# Altium schematic sheet smartlock.SchDoc
size A4; SheetNumber: 1; SheetTotal: 1
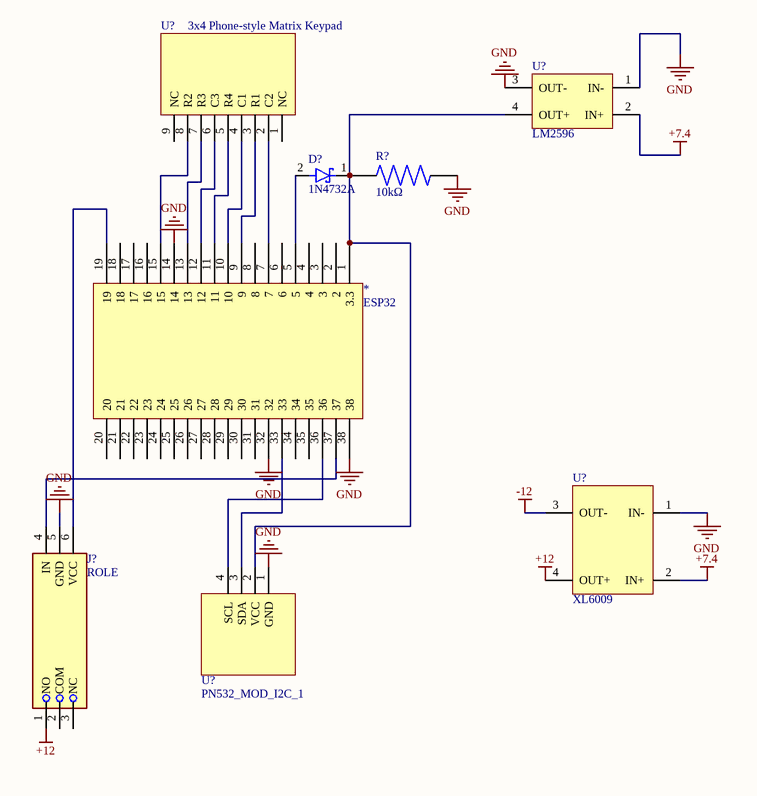
[diagram p0: smartlock.SchDoc]

## Parts
(Parts that share a designator on the sheet are numbered #1, #2 ... from top to bottom, then left to right.)
*  ESP32  [ESP32]
D?  1N4732A  [1N4732A]
J?  ROLE  [ROLE]
R?  10kΩ  [10k?]
U?#1  LM2596  [LM2698]
U?#2  3x4 Phone-style Matrix Keypad  [3x4 Phone-style Matrix Keypad]
U?#3  XL6009  [XL6009]
U?#4  PN532_MOD_I2C_1  [PN532_NFC_MOD_I2C]

## Nets
+7.4: U?#1.2(IN+) U?#3.2(IN+)
+12: J?.1(NO) U?#3.4(OUT+)
-12: U?#3.3(OUT-)
GND: *.14 *.32 *.38 J?.5(GND) R?.2 U?#1.1(IN-) U?#1.3(OUT-) U?#3.1(IN-) U?#4.1(GND)
Net*_1: *.1(3.3) D?.1(K) R?.1 U?#1.4(OUT+) U?#4.2(VCC)
Net*_5: *.5 D?.2(A)
Net*_7: *.7 U?#2.2(C2)
Net*_9: *.9 U?#2.3(R1)
Net*_10: *.10 U?#2.4(C1)
Net*_11: *.11 U?#2.5(R4)
Net*_12: *.12 U?#2.6(C3)
Net*_13: *.13 U?#2.7(R3)
Net*_15: *.15 U?#2.8(R2)
Net*_19: *.19 J?.6(VCC)
Net*_33: *.33 U?#4.3(SDA)
Net*_36: *.36 U?#4.4(SCL)
Net*_37: *.37 J?.4(IN)

Not connected (* = marked no-connect by the designer): * 2 3 4 6 8 16 17 18 20 21 22 23 24 25 26 27 28 29 30 31 34 35; J? 2(COM) 3(NC); U?#2 1(NC) 9(NC)

## Library data of the parts
D? = 1N4732A: Zener Diode 4.7 V 1 W Â±5% Through Hole DO-41; MF: ON Semiconductor; SnapEDA_Link: https://www.snapeda.com/parts/1N4732A/Onsemi/view-part/?ref=snap; Package: DO-41 ON Semiconductor; Value: *; MP: 1N4732A; Check_prices: https://www.snapeda.com/parts/1N4732A/Onsemi/view-part/?ref=eda
J? = ROLE: PCB Terminal Screw 5mm 12AWG 400V 24A 3 Position COMBICON MKDSP Series | Phoenix Contact 1714036; SnapEDA_Link: https://www.snapeda.com/parts/1714036/Phoenix+Contact/view-part/?ref=snap; Package: None; Value: *; MF: Phoenix Contact; MP: 1714036; Check_prices: https://www.snapeda.com/parts/1714036/Phoenix+Contact/view-part/?ref=eda
R? = 10kΩ: MF: Yageo; MP: MFR-25FBF52-1K; SnapEDA_Link: https://www.snapeda.com/parts/MFR-25FBF52-1K/Yageo/view-part/?ref=snap; Package: RADIAL-2 YAGEO; Value: *; Check_prices: https://www.snapeda.com/parts/MFR-25FBF52-1K/Yageo/view-part/?ref=eda